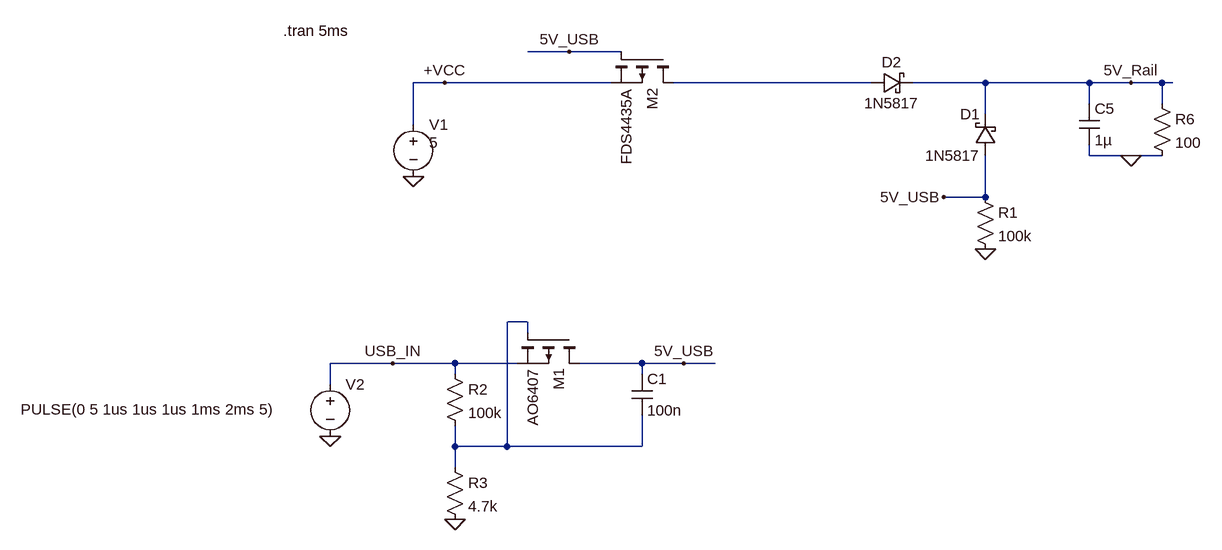
[diagram p0: schematic 5V USB Autotransfer.asc]
5V USB Autotransfer.asc, the LTspice schematic file:
Version 4
SHEET 1 2088 1124
WIRE -608 -32 -672 -32
WIRE -528 -32 -608 -32
WIRE -800 16 -848 16
WIRE -544 16 -800 16
WIRE -144 16 -448 16
WIRE 32 16 -80 16
WIRE 192 16 32 16
WIRE 256 16 192 16
WIRE 304 16 256 16
WIRE 320 16 304 16
WIRE 192 48 192 16
WIRE 304 48 304 16
WIRE 32 64 32 16
WIRE -848 80 -848 16
WIRE 192 128 192 112
WIRE 256 128 192 128
WIRE 304 128 256 128
WIRE 32 192 32 128
WIRE 32 192 -32 192
WIRE -672 384 -704 384
WIRE -672 400 -672 384
WIRE -880 448 -976 448
WIRE -784 448 -880 448
WIRE -688 448 -784 448
WIRE -496 448 -592 448
WIRE -432 448 -496 448
WIRE -384 448 -432 448
WIRE -784 464 -784 448
WIRE -496 464 -496 448
WIRE -976 480 -976 448
WIRE -784 576 -784 544
WIRE -704 576 -704 384
WIRE -704 576 -784 576
WIRE -496 576 -496 528
WIRE -496 576 -704 576
WIRE -784 608 -784 576
FLAG -800 16 +VCC
FLAG -608 -32 5V_USB
FLAG 256 128 0
FLAG -32 192 5V_USB
FLAG 32 272 0
FLAG -848 160 0
FLAG -976 560 0
FLAG -432 448 5V_USB
FLAG 256 16 5V_Rail
FLAG -784 688 0
FLAG -880 448 USB_IN
SYMBOL voltage -848 64 R0
WINDOW 3 24 44 Left 2
WINDOW 123 0 0 Left 2
WINDOW 39 0 0 Left 2
SYMATTR Value 5
SYMATTR InstName V1
SYMBOL pmos -448 -32 R90
SYMATTR InstName M2
SYMATTR Value FDS4435A
SYMBOL cap 176 48 R0
SYMATTR InstName C5
SYMATTR Value 1µ
SYMBOL res 288 32 R0
SYMATTR InstName R6
SYMATTR Value 100
SYMBOL schottky 48 128 R180
WINDOW 0 24 64 Left 2
WINDOW 3 24 0 Left 2
SYMATTR InstName D1
SYMATTR Value 1N5817
SYMATTR Description Diode
SYMATTR Type diode
SYMBOL res 16 176 R0
SYMATTR InstName R1
SYMATTR Value 100k
SYMBOL voltage -976 464 R0
WINDOW 3 -476 55 Left 2
WINDOW 123 0 0 Left 2
WINDOW 39 0 0 Left 2
SYMATTR Value PULSE(0 5 1us 1us 1us 1ms 2ms 5)
SYMATTR InstName V2
SYMBOL res -800 448 R0
SYMATTR InstName R2
SYMATTR Value 100k
SYMBOL res -800 592 R0
SYMATTR InstName R3
SYMATTR Value 4.7k
SYMBOL cap -512 464 R0
SYMATTR InstName C1
SYMATTR Value 100n
SYMBOL pmos -592 400 R90
SYMATTR InstName M1
SYMATTR Value AO6407
SYMBOL schottky -144 32 R270
WINDOW 0 32 32 VTop 2
WINDOW 3 0 32 VBottom 2
SYMATTR InstName D2
SYMATTR Value 1N5817
SYMATTR Description Diode
SYMATTR Type diode
TEXT -1048 -64 Left 2 !.tran 5ms

The netlist it stands for:
* 5V USB Autotransfer.asc
V1 +VCC 0 5
M2 N001 5V_USB +VCC +VCC FDS4435A
C5 5V_Rail 0 1µ
R6 5V_Rail 0 100
D1 5V_USB 5V_Rail 1N5817
R1 5V_USB 0 100k
V2 USB_IN 0 PULSE(0 5 1us 1us 1us 1ms 2ms 5)
R2 USB_IN N002 100k
R3 N002 0 4.7k
C1 5V_USB N002 100n
M1 5V_USB N002 USB_IN USB_IN AO6407
D2 N001 5V_Rail 1N5817
.model D D
.lib standard.dio
.model NMOS NMOS
.model PMOS PMOS
.lib standard.mos
.tran 5ms
.backanno
.end